# EAGLE design Módulo U.V.B. v.1.0 (EAGLE 9.4.2)
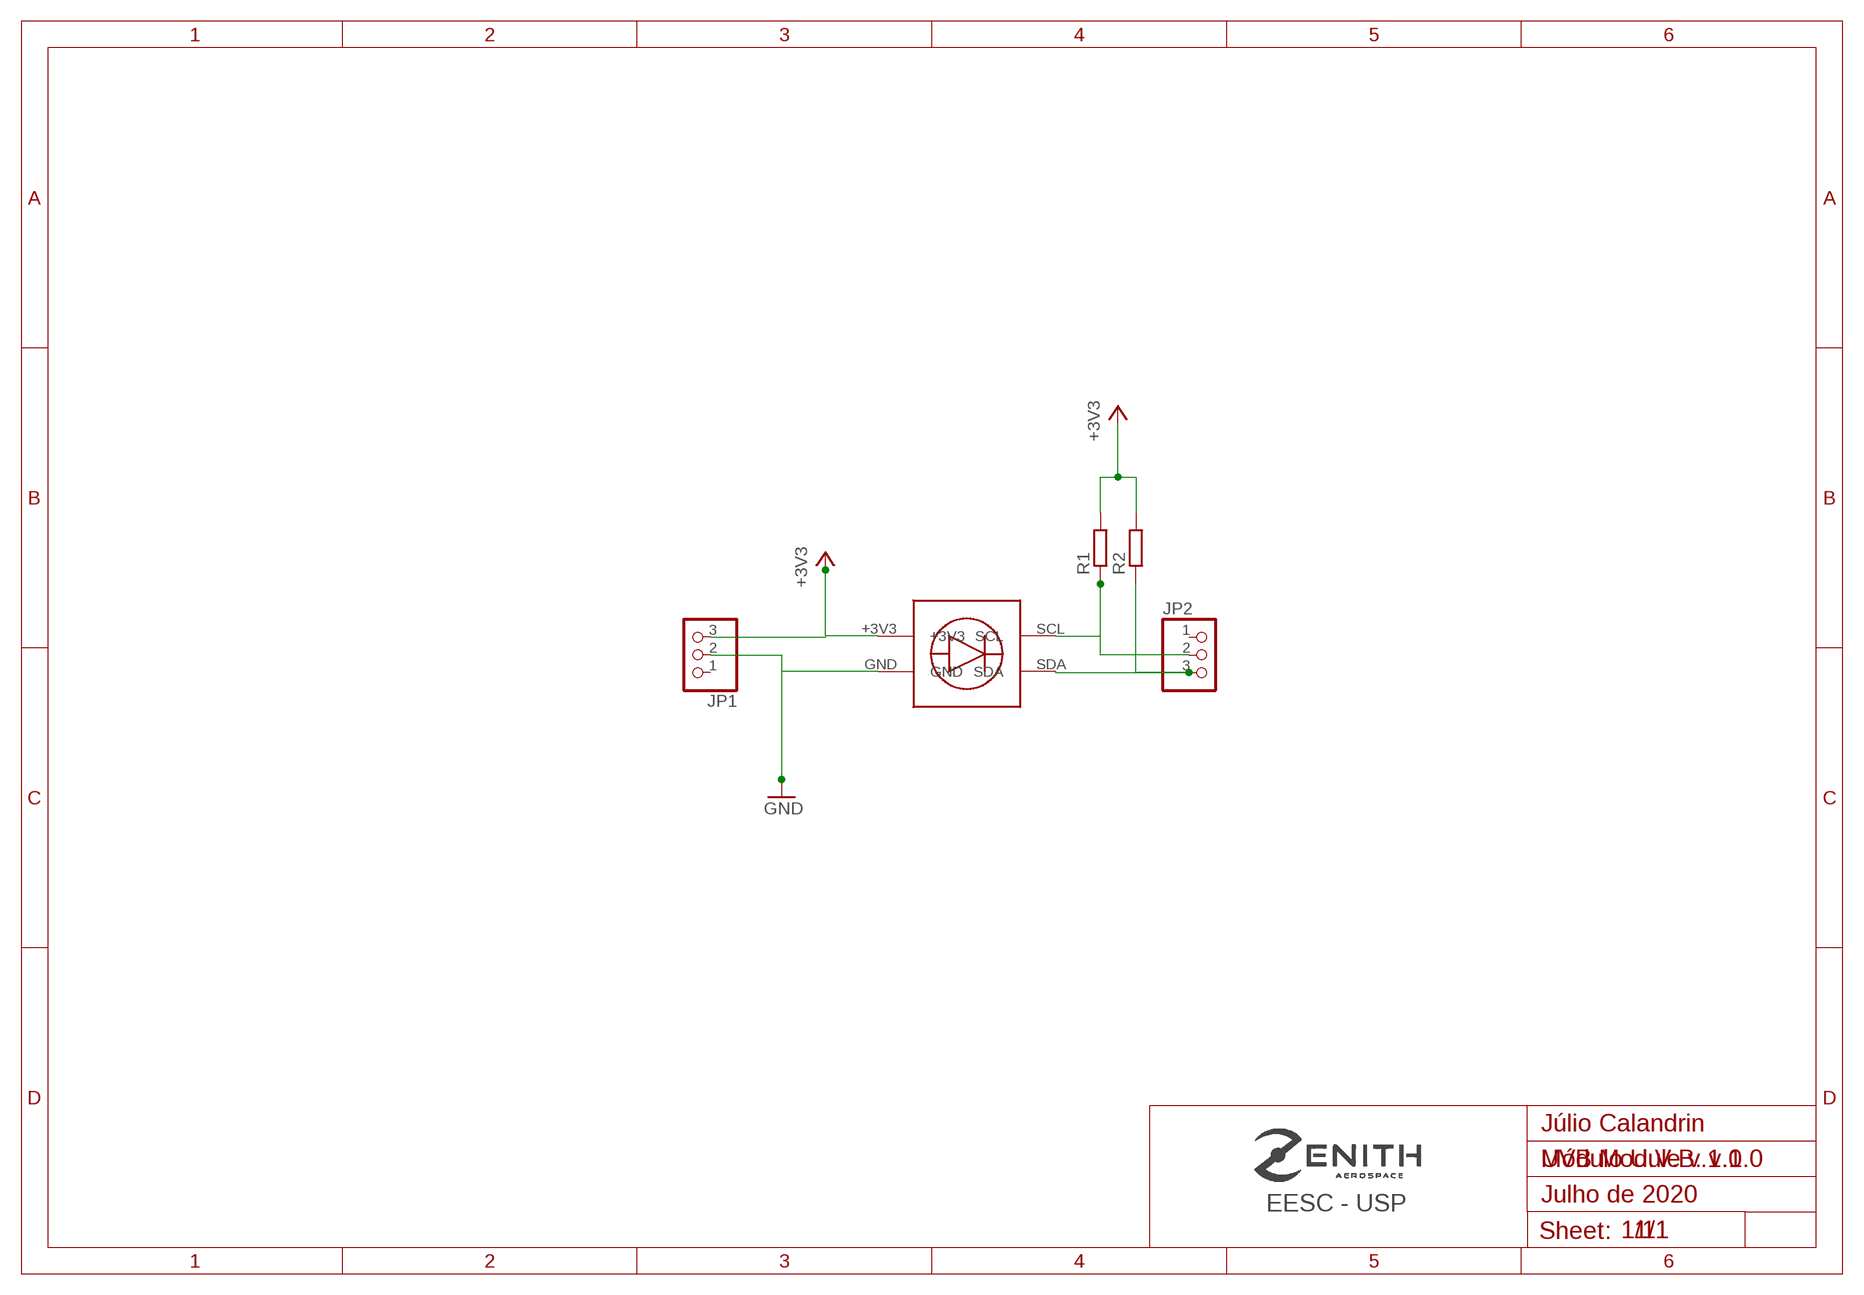
[diagram p0: schematic, sheet 1]

## Parts
JP1  PINHD-1X3  [1X03]
JP2  PINHD-1X3  [1X03]
R1  R-EU_R0805  [R0805]
R2  R-EU_R0805  [R0805]
U$1  BREAKOUT_UV-B  [PADS_UV-A/B]

## Nets
+3V3: JP1.3 R1.2 R2.2 U$1.+3V3
GND: JP1.2 U$1.GND
N$1: JP2.3 R2.1 U$1.SDA
N$3: JP2.2 R1.1 U$1.SCL
Unconnected: JP1.1 JP2.1

## Notes on the sheet
- Júlio Calandrin
- UVB Module v.1.0
- EESC - USP | Julho de 2020
- 1/1

## Library data of the parts
JP1 JP2 = pinhead(1x3):PINHD-1X3: PIN HEADER
R1 R2 = rcl:R-EU_: RESISTOR, European symbol; SPICEPREFIX: R
U$1 = Zenith_Breakouts:BREAKOUT_UV-B

## Board
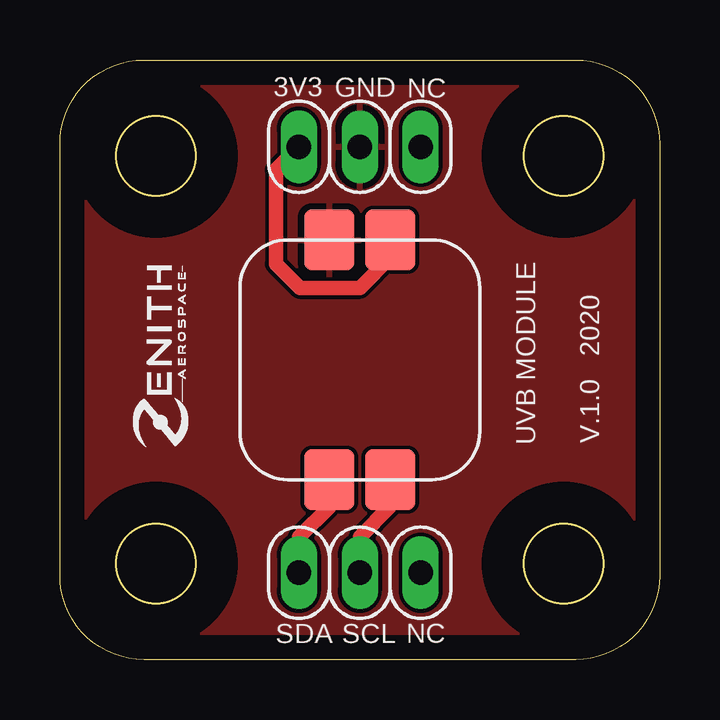
[diagram p1: board, top side]
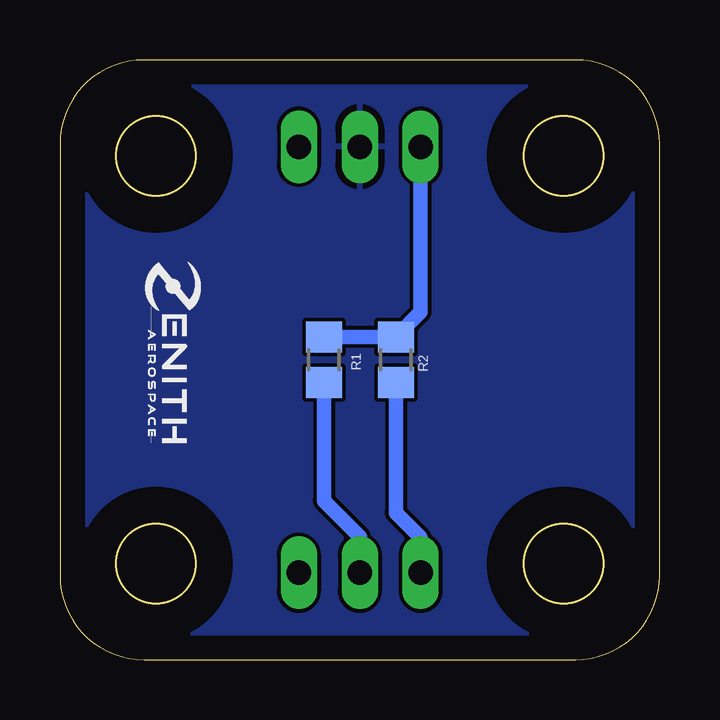
[diagram p2: board, bottom side, seen from below]

Size 25 x 25 mm. Coordinates in mm from the lower left corner, seen from the top.
Outline: 0,3.5 0,21.5 arc-90 3.5,25 21.5,25 arc-90 25,21.5 25,3.5 arc-90 21.5,0 3.5,0 arc-90 0,3.5
Outline: circle at 4,21 radius 1.65
Outline: circle at 21,21 radius 1.65
Outline: circle at 4,4 radius 1.65
Outline: circle at 21,4 radius 1.65
Copper layers (1*16): Top 0.035mm / dielectric 1.5mm / Bottom 0.035mm
Design rules "default": minimum track width 6mil, minimum drill 0.35mm, track to track 6mil, track to pad 6mil, pad to pad 6mil, via to via 6mil, smd to smd 6mil, copper to edge 40mil, drill to drill 6mil, minimum pad ring 10mil, minimum via ring 8mil, stop-mask expansion 4mil, vias tented up to drill 0mil, thermal gap 10mil
tRestrict: area 0.8,17.8 to 7.2,24.2; area 17.8,17.8 to 24.2,24.2; area 0.8,0.8 to 7.2,7.2; area 17.8,0.8 to 24.2,7.2
bRestrict: area 1,18 to 7,24; area 18,18 to 24,24; area 18,1 to 24,7; area 1,1 to 7,7

### Footprints (pad centres in the part's own frame; a part is rotated, then mirrored left to right if it is on the bottom)
1X03 = drill 1.016 long: 1 -2.54,0; 2 0,0; 3 2.54,0
R0805 = smd 1.3 x 1.5: 1 -0.95,0; 2 0.95,0
PADS_UV-A/B = smd 2.54 x 2.1: +3V3 -5,1.27; GND -5,-1.27; SCL 5,1.27; SDA 5,-1.27

### Placement (x,y rotation side)
JP1  12.5,21.38 180 top
JP2  12.5,3.62 180 top
R1  14,12.5 90 bottom
R2  11,12.5 90 bottom
U$1  12.5,12.5 270 top

### Tracks (layer width: path | path; a pad name or v marks a point on that pad's centre or on a via)
+3V3
  Top 0.61: JP1.3 9,20.42 9,16.5 10,15.5 12.5,15.5 13.77,16.77 U$1.+3V3
  Bottom 0.61: JP1.3 9.96,14.49 R2.2 R1.2
GND
  pour Top: -0.5,25.5 -0.5,-0.5 25.5,-0.5 25.5,25.5
  pour Bottom: -0.5,25.5 -0.5,-0.5 25.5,-0.5 25.5,25.5 0,25.5
N$1
  Top 0.61: JP2.3 9.96,5.11 11.23,6.38 U$1.SDA
  Bottom 0.61: R2.1 11,6.12 9.96,5.09 JP2.3
N$3
  Top 0.61: JP2.2 12.5,5.12 13.77,6.39 U$1.SCL
  Bottom 0.61: R1.1 14,6.62 12.5,5.12 JP2.2

### Text on the board
tNames: D:/Zenith/Logos Zenith/Z+Escrito_bmp.bmp | 3V3 | GND | NC | UVB MODULE | V.1.0 2020 | SDA | SCL | NC